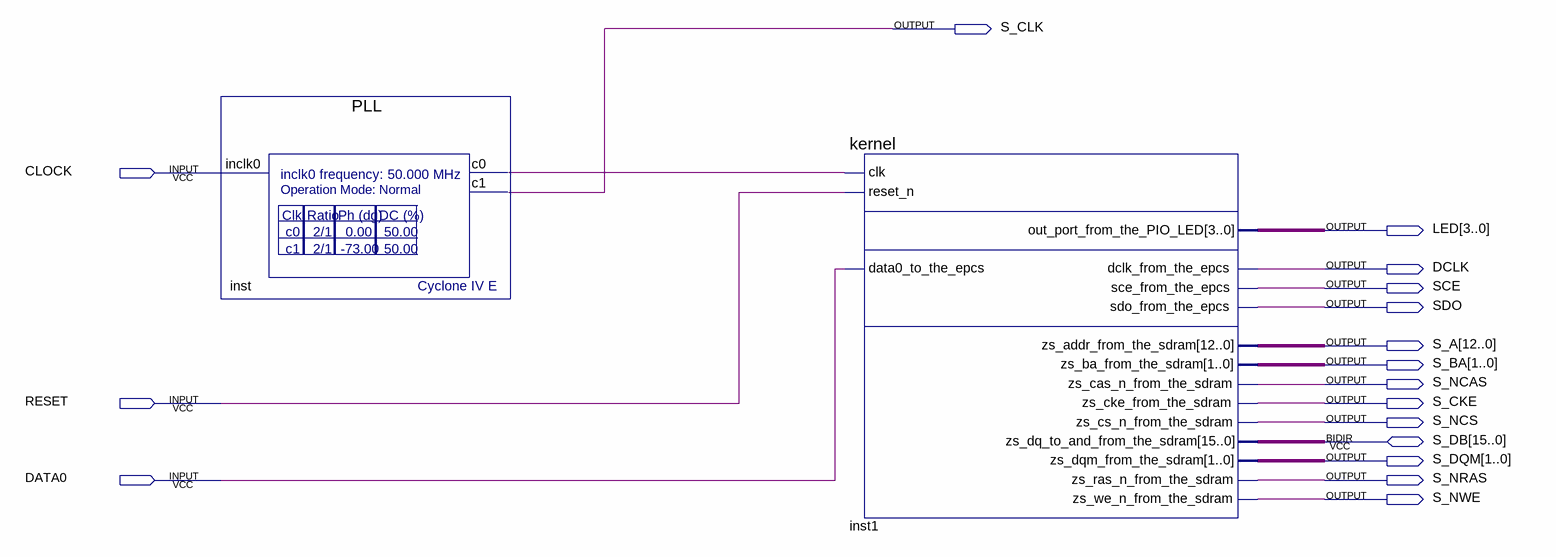
[diagram p0: schematic sheet]
// Quartus schematic top.bdf as structural Verilog: 2 symbols, 17 pins
module top (
  input  CLOCK,
  input  RESET,
  input  DATA0,
  inout  [15:0] S_DB,
  output S_CLK,
  output [3:0] LED,
  output DCLK,
  output SCE,
  output SDO,
  output [12:0] S_A,
  output [1:0] S_BA,
  output S_NCAS,
  output S_CKE,
  output S_NCS,
  output [1:0] S_DQM,
  output S_NRAS,
  output S_NWE
);

  wire inst_c0;

  PLL inst (.inclk0(CLOCK), .c0(inst_c0), .c1(S_CLK));
  kernel inst1 (
    .clk(inst_c0), .reset_n(RESET), .data0_to_the_epcs(DATA0), .out_port_from_the_PIO_LED(LED),
    .dclk_from_the_epcs(DCLK), .sce_from_the_epcs(SCE), .sdo_from_the_epcs(SDO),
    .zs_addr_from_the_sdram(S_A), .zs_ba_from_the_sdram(S_BA), .zs_cas_n_from_the_sdram(S_NCAS),
    .zs_cke_from_the_sdram(S_CKE), .zs_cs_n_from_the_sdram(S_NCS), .zs_dqm_from_the_sdram(S_DQM),
    .zs_ras_n_from_the_sdram(S_NRAS), .zs_we_n_from_the_sdram(S_NWE), .zs_dq_to_and_from_the_sdram(S_DB));
endmodule
